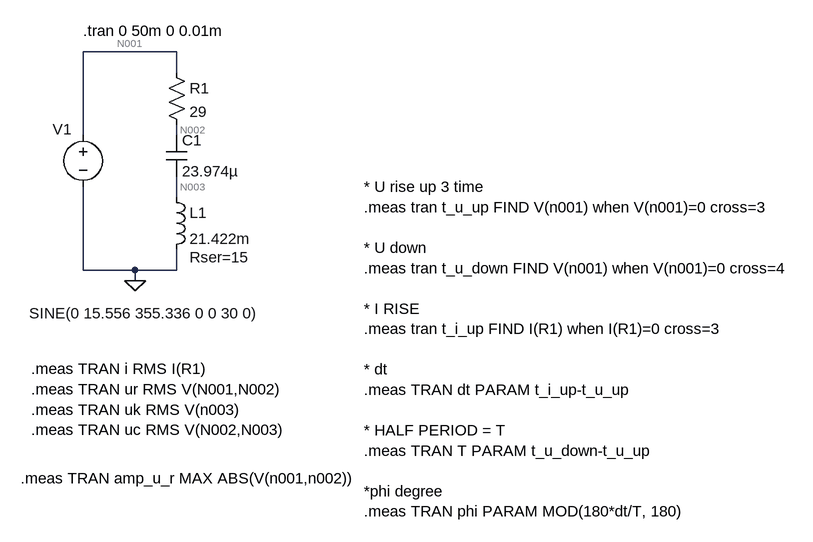
[diagram p0: schematic 2_6.asc]
2_6.asc, the LTspice schematic file:
Version 4.1
SHEET 1 1596 744
WIRE 320 -48 176 -48
WIRE 320 -16 320 -48
WIRE 176 80 176 -48
WIRE 320 80 320 64
WIRE 320 176 320 144
WIRE 176 288 176 160
WIRE 256 288 176 288
WIRE 320 288 320 256
WIRE 320 288 256 288
WIRE 256 304 256 288
FLAG 256 304 0
SYMBOL voltage 176 64 R0
WINDOW 123 0 0 Left 0
WINDOW 39 24 124 Left 2
WINDOW 0 -47 7 Left 2
WINDOW 3 -83 290 Left 2
SYMATTR InstName V1
SYMATTR Value SINE(0 15.556 355.336 0 0 30 0)
SYMBOL res 304 -32 R0
SYMATTR InstName R1
SYMATTR Value 29
SYMBOL ind 304 160 R0
WINDOW 39 36 108 Left 2
SYMATTR SpiceLine Rser=15
SYMATTR InstName L1
SYMATTR Value 21.422m
SYMBOL cap 304 80 R0
SYMATTR InstName C1
SYMATTR Value 23.974µ
TEXT 176 -80 Left 2 !.tran 0 50m 0 0.01m
TEXT 96 440 Left 2 !.meas TRAN i RMS I(R1)\n.meas TRAN ur RMS V(N001,N002)\n.meas TRAN uk RMS V(n003)\n.meas TRAN uc RMS V(N002,N003)
TEXT 608 160 Left 2 !* U rise up 3 time\n.meas tran t_u_up FIND V(n001) when V(n001)=0 cross=3\n \n* U down\n.meas tran t_u_down FIND V(n001) when V(n001)=0 cross=4\n \n* I RISE\n.meas tran t_i_up FIND I(R1) when I(R1)=0 cross=3\n \n* dt\n.meas TRAN dt PARAM t_i_up-t_u_up\n \n* HALF PERIOD = T\n.meas TRAN T PARAM t_u_down-t_u_up\n \n*phi degree\n.meas TRAN phi PARAM MOD(180*dt/T, 180)
TEXT 80 608 Left 2 !.meas TRAN amp_u_r MAX ABS(V(n001,n002))

The netlist it stands for:
* 2_6.asc
V1 N001 0 SINE(0 15.556 355.336 0 0 30 0)
R1 N001 N002 29
L1 N003 0 21.422m Rser=15
C1 N002 N003 23.974µ
.tran 0 50m 0 0.01m
.meas TRAN i RMS I(R1)
.meas TRAN ur RMS V(N001,N002)
.meas TRAN uk RMS V(n003)
.meas TRAN uc RMS V(N002,N003)
* U rise up 3 time
.meas tran t_u_up FIND V(n001) when V(n001)=0 cross=3
* U down
.meas tran t_u_down FIND V(n001) when V(n001)=0 cross=4
* I RISE
.meas tran t_i_up FIND I(R1) when I(R1)=0 cross=3
* dt
.meas TRAN dt PARAM t_i_up-t_u_up
* HALF PERIOD = T
.meas TRAN T PARAM t_u_down-t_u_up
*phi degree
.meas TRAN phi PARAM MOD(180*dt/T, 180)
.meas TRAN amp_u_r MAX ABS(V(n001,n002))
.backanno
.end

* Results of the author's LTspice run, read from the files saved beside the schematic
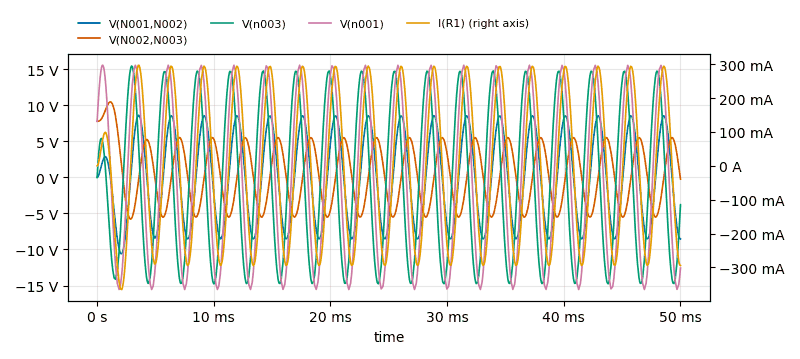
[diagram p1: Transient Analysis of 2_6.asc, plotted from the saved traces]
* Transient Analysis, 1 run:
*   V(N001,N002): min -10.59 V, max 8.622 V, average -111.1 mV, rms 6.027 V, last -8.539 V
*   V(N002,N003): min -5.795 V, max 10.47 V, average 333.8 mV, rms 4.189 V, last -242.6 mV
*   V(n003): min -14.77 V, max 15.45 V, average -182.8 mV, rms 10.37 V, last -3.796 V
*   V(n001): min -15.55 V, max 15.55 V, average 39.88 mV, rms 11.01 V, last -12.58 V
*   I(R1): min -365.3 mA, max 297.3 mA, average -3.832 mA, rms 207.8 mA, last -294.5 mA
* From the log:
*   i: RMS(I(R1))=0.208034992766 FROM 0 TO 0.05
*   ur: RMS(V(N001,N002))=6.03301478636 FROM 0 TO 0.05
*   uk: RMS(V(n003))=10.3864183471 FROM 0 TO 0.05
*   uc: RMS(V(N002,N003))=4.184818986 FROM 0 TO 0.05
*   t_u_up: V(n001)=-1.1990408666e-14 at 0.00398684067934
*   t_u_down: V(n001)=5.99520433298e-15 at 0.00539395576503
*   t_i_up: I(R1)=1.97324795392e-17 at 0.00113622296812
*   dt: t_i_up-t_u_up=1.20101411455e-14
*   t: t_u_down-t_u_up=1.79856129989e-14
*   phi: MOD(180*dt/T, 180)=120.197482639
*   amp_u_r: MAX(ABS(V(n001,n002)))=10.6369625548 FROM 0 TO 0.05